# EAGLE design esp8266_schematic (EAGLE 9.4.2)
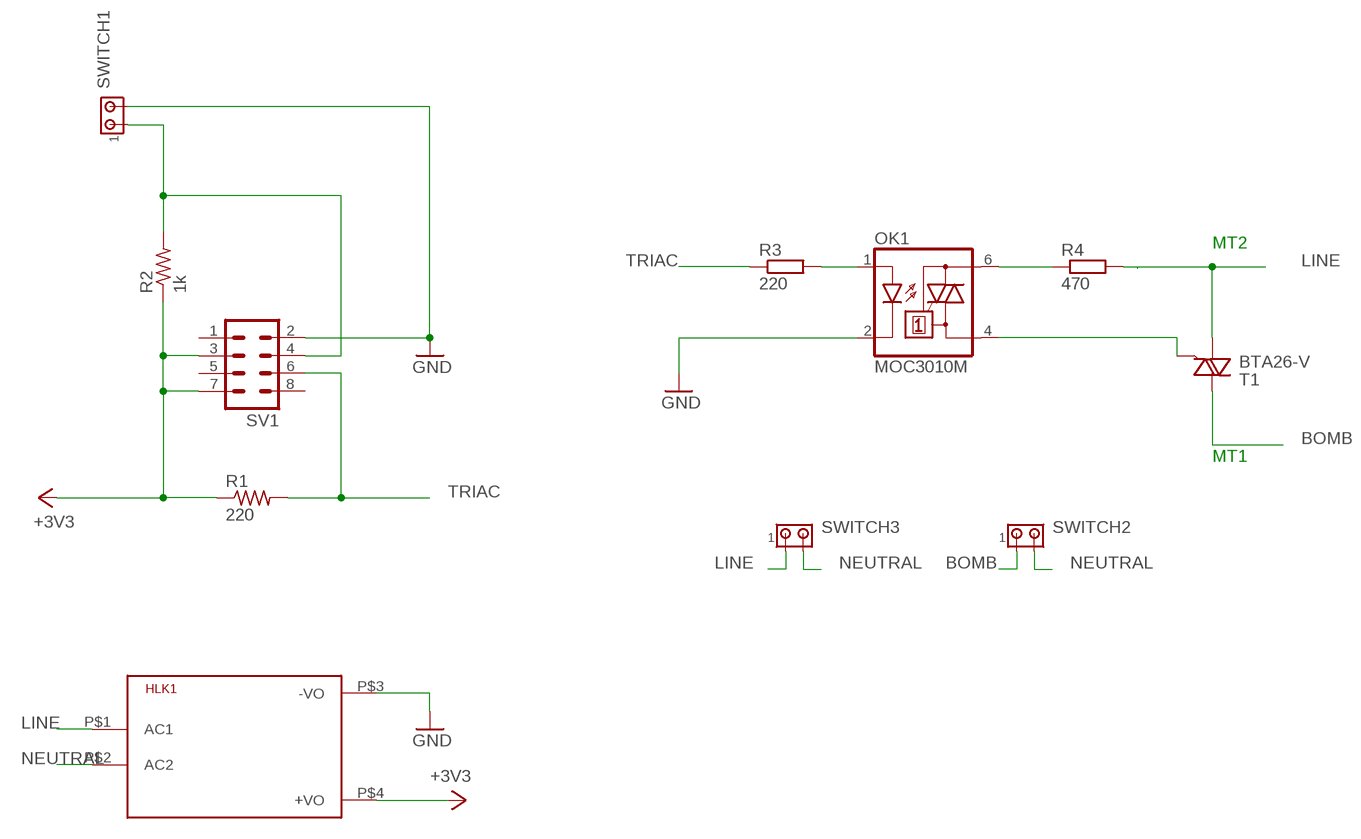
[diagram p0: schematic, sheet 1]

## Parts
HLK1  HLK-PM013W  [HLK-PM01]
OK1  MOC3010M  [DIL06]
R1  220  R-US_0207/2V  [0207/2V]
R2  1k  R-US_0207/2V  [0207/2V]
R3  220  R-EU_0204/5  [0204/5]
R4  470  R-EU_0207/15  [0207/15]
SV1  MA04-2  [MA04-2]
SWITCH1  MTA02-100  [10X02MTA]
SWITCH2  MTA02-100  [10X02MTA]
SWITCH3  MTA02-100  [10X02MTA]
T1  BTA26-V  [TOP3S-1]

## Nets
+3V3: HLK1.P$4(+VO) R1.1 R2.1 SV1.3 SV1.7
BOMB: SWITCH2.1 T1.A2
GND: HLK1.P$3(-VO) OK1.2(C) SV1.2 SWITCH1.2
LINE: HLK1.P$1(AC1) R4.2 SWITCH3.1 T1.A1
N$1: OK1.1(A) R3.2
N$3: R2.2 SV1.4 SWITCH1.1
N$4: OK1.6(A2) R4.1
N$6: OK1.4(A1) T1.G
NEUTRAL: HLK1.P$2(AC2) SWITCH2.2 SWITCH3.2
TRIAC: R1.2 R3.1 SV1.6
Unconnected: SV1.1 SV1.5 SV1.8

## Notes on the sheet
- MT2
- MT1

## Library data of the parts
HLK1 = HLK-PM01:HLK-PM01: Hi-Link Power Supply HLK-PM01 3W Author: Ahmed Said <https://github.com/AhmedSaid/EAGLELibraries>
OK1 = optocoupler:MOC30*M: RANDOM-PHASE OPTOISOLATORS TRIAC DRIVER OUTPUT Source: http://www.fairchildsemi.com MOC3020-M.pdf; MF: FAIRCHILD SEMICONDUCTOR; MPN: MOC3010-M; OC_FARNELL: 1505423; OC_NEWARK: 72K8892
R1 R2 = rcl:R-US_: RESISTOR, American symbol; SPICEPREFIX: R
R3 R4 = rcl:R-EU_: RESISTOR, European symbol; SPICEPREFIX: R
SV1 = con-lstb:MA04-2: PIN HEADER; OC_FARNELL: unknown; OC_NEWARK: unknown
SWITCH1-SWITCH3 = con-amp:MTA02-100: AMP connector
T1 = triac:BTA26: 25A TRIAC Source: http://www.st.com/stonline/products/literature/ds/7470.pdf

## Board
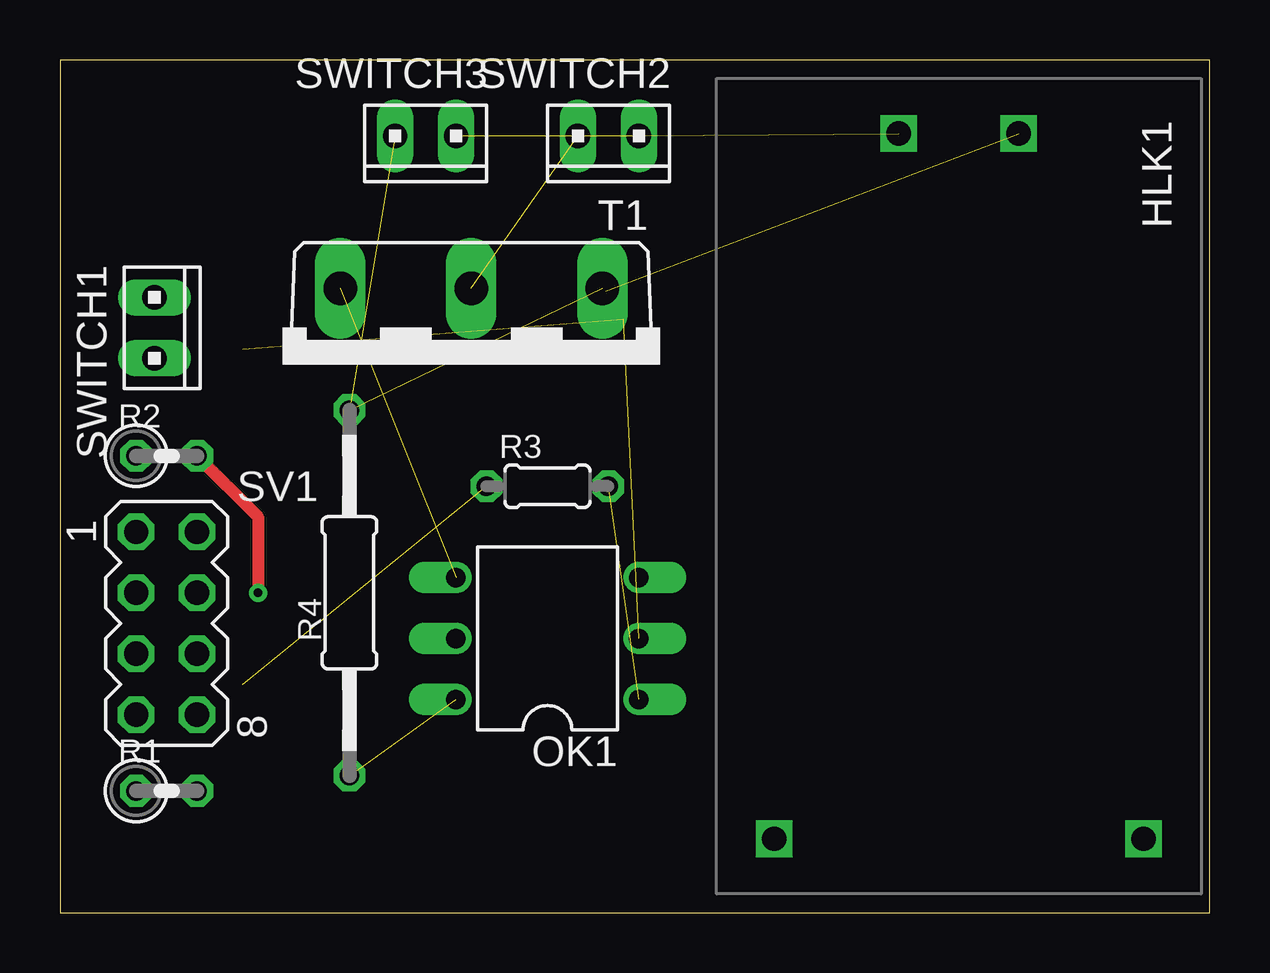
[diagram p1: board, top side]
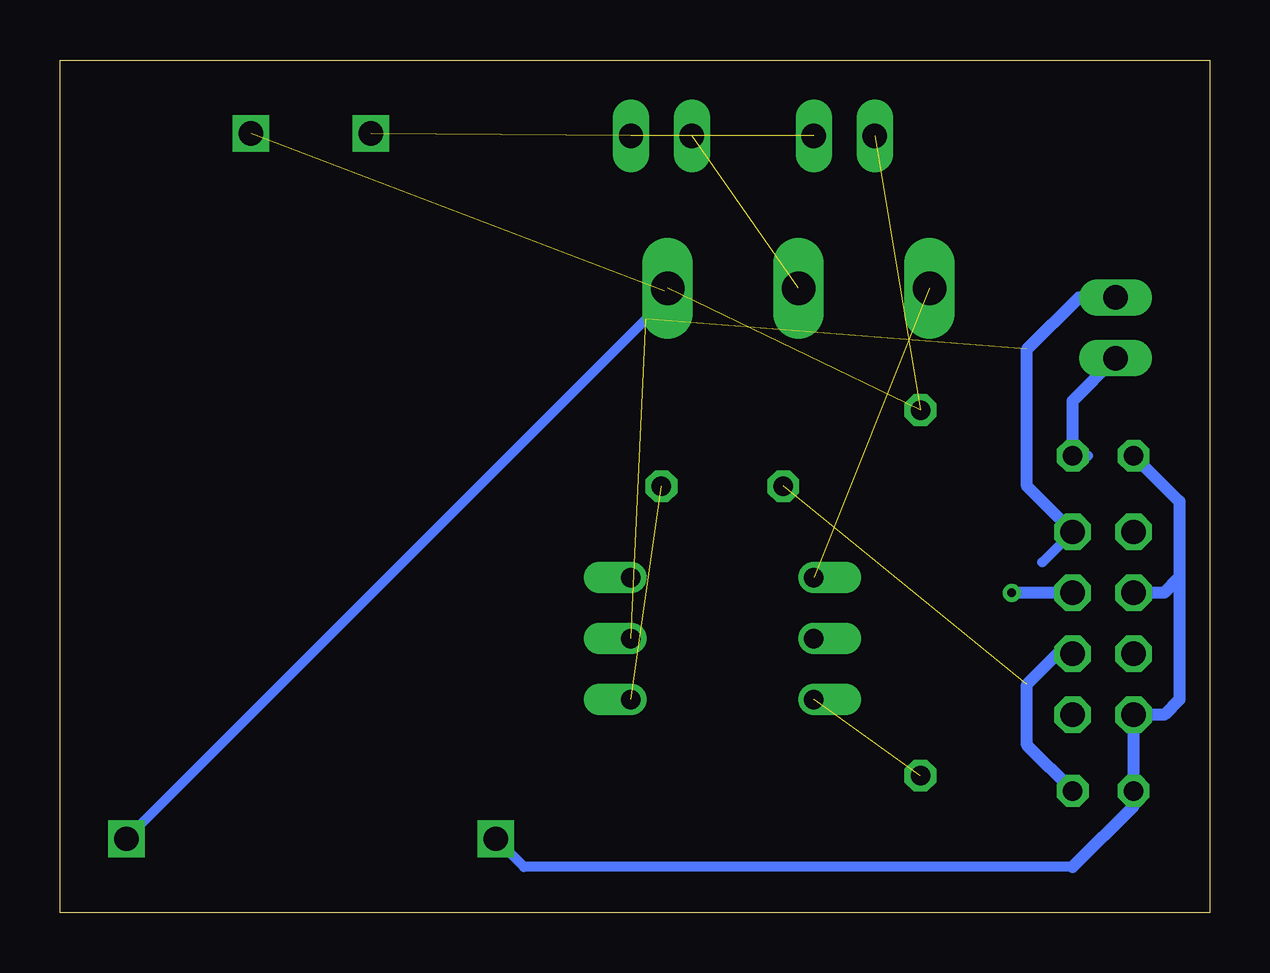
[diagram p2: board, bottom side, seen from below]

Size 47.93 x 35.55 mm. Coordinates in mm from the lower left corner, seen from the top.
Outline: 0,0 47.93,0 47.93,35.55 0,35.55 0,0
Copper layers (1*16): Top 0.035mm / dielectric 1.5mm / Bottom 0.035mm
Design rules "default *": minimum track width 10mil, minimum drill 0.35mm, track to track 6mil, track to pad 1mil, pad to pad 6mil, via to via 6mil, smd to smd 6mil, copper to edge 40mil, drill to drill 6mil, minimum pad ring 10mil, minimum via ring 8mil, stop-mask expansion 4mil, vias tented up to drill 0mil, thermal gap 10mil

### Footprints (pad centres in the part's own frame; a part is rotated, then mirrored left to right if it is on the bottom)
HLK-PM01 = drill 1.016 square: P$1 -14.7,2.5; P$2 -14.7,-2.5; P$3 14.7,7.7; P$4 14.7,-7.7
DIL06 = drill 0.813 offset: 1 -2.54,-3.81; 2 0,-3.81; 3 2.54,-3.81; 4 2.54,3.81; 5 0,3.81; 6 -2.54,3.81
0207/2V = drill 0.813 octagon: 1 -1.27,0; 2 1.27,0
0204/5 = drill 0.813 octagon: 1 -2.54,0; 2 2.54,0
0207/15 = drill 0.813 octagon: 1 -7.62,0; 2 7.62,0
MA04-2 = drill 1.016 octagon: 1 -3.81,-1.27; 2 -3.81,1.27; 3 -1.27,-1.27; 4 -1.27,1.27; 5 1.27,-1.27; 6 1.27,1.27; 7 3.81,-1.27; 8 3.81,1.27
10X02MTA = drill 1.016 long: 1 1.27,0; 2 -1.27,0
TOP3S-1 = drill 1.397 long: A1 -5.461,-3.175; A2 0,-3.175; G 5.461,-3.175

### Placement (x,y rotation side)
HLK1  37.46,17.78 270 top
OK1  20.32,11.43 90 top
R1  4.44,5.08 0 top
R2  4.44,19.05 0 top
R3  20.32,17.78 0 top
R4  12.06,13.34 90 top
SV1  4.44,12.07 270 top
SWITCH1  3.94,24.38 270 top
SWITCH2  22.86,32.39 180 top
SWITCH3  15.24,32.39 180 top
T1  17.14,22.86 180 top

### Tracks (layer width: path | path; a pad name or v marks a point on that pad's centre or on a via)
+3V3
  Bottom 0.406: HLK1.P$4 28.59,1.91 5.71,1.91
  Bottom 0.508: R2.1 1.27,17.14 1.27,13.97 | 1.27,13.97 1.9,13.34 SV1.3 | 1.27,13.97 1.27,8.89 1.9,8.25 SV1.7 R1.1 3.17,4.45 5.71,1.91
BOMB  (1 unrouted)
GND  (2 unrouted)
  Bottom 0.406: 6.98,14.61 SV1.2 | HLK1.P$3 23.49,24.75
  Bottom 0.508: SV1.2 7.62,17.78 7.62,23.5 5.46,25.65 SWITCH1.2
LINE  (3 unrouted)
  Bottom 0.406: 22.73,25.91 T1.A1
N$1  (1 unrouted)
N$3  (via drill 0.35)
  Top 0.508: R2.2 8.26,16.51 v8.26,13.34
  Bottom 0.406: R2.2 5.08,19.05
  Bottom 0.508: R2.2 5.71,21.34 SWITCH1.1 | SV1.4 v8.26,13.34
N$4  (1 unrouted)
N$6  (1 unrouted)
NEUTRAL  (2 unrouted)
TRIAC  (1 unrouted)
  Bottom 0.508: R1.2 7.62,6.99 7.62,9.52 6.35,10.8 SV1.6